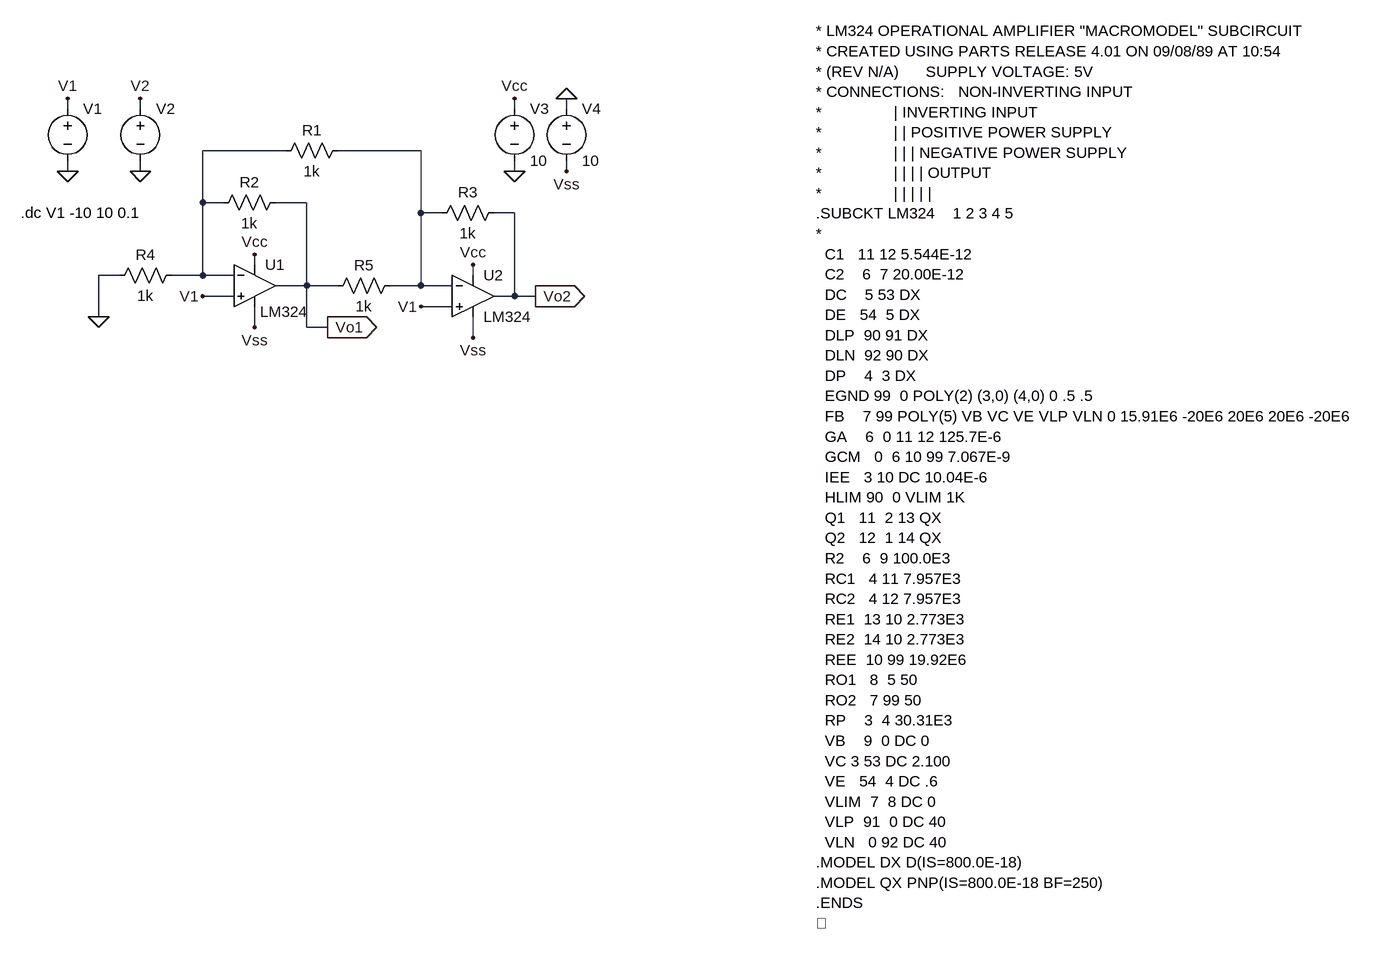
[diagram p0: schematic L1_C1.asc]
L1_C1.asc, the LTspice schematic file:
Version 4
SHEET 1 1776 1048
WIRE -144 -80 -144 -96
WIRE -32 -80 -32 -96
WIRE 544 -80 544 -96
WIRE 624 -80 624 -96
WIRE 192 -16 64 -16
WIRE 400 -16 272 -16
WIRE -144 16 -144 0
WIRE -32 16 -32 0
WIRE 544 16 544 0
WIRE 624 16 624 0
WIRE 64 64 64 -16
WIRE 96 64 64 64
WIRE 224 64 176 64
WIRE 400 80 400 -16
WIRE 432 80 400 80
WIRE 544 80 512 80
WIRE 144 160 144 144
WIRE -64 176 -96 176
WIRE 64 176 64 64
WIRE 64 176 16 176
WIRE 112 176 64 176
WIRE 480 176 480 160
WIRE 224 192 224 64
WIRE 224 192 176 192
WIRE 272 192 224 192
WIRE 400 192 400 80
WIRE 400 192 352 192
WIRE 448 192 400 192
WIRE 112 208 64 208
WIRE 544 208 544 80
WIRE 544 208 512 208
WIRE 576 208 544 208
WIRE 448 224 400 224
WIRE -96 240 -96 176
WIRE 144 256 144 224
WIRE 224 256 224 192
WIRE 256 256 224 256
WIRE 480 272 480 240
FLAG -144 16 0
FLAG -32 16 0
FLAG -96 240 0
FLAG 544 16 0
FLAG 64 208 V1
FLAG 400 224 V1
FLAG -144 -96 V1
FLAG -32 -96 V2
FLAG 624 -96 0
FLAG 544 -96 Vcc
FLAG 144 144 Vcc
FLAG 480 160 Vcc
FLAG 624 16 Vss
FLAG 480 272 Vss
FLAG 144 256 Vss
FLAG 576 208 Vo2
IOPIN 576 208 Out
FLAG 256 256 Vo1
IOPIN 256 256 Out
SYMBOL res 288 -32 R90
WINDOW 0 0 56 VBottom 2
WINDOW 3 32 56 VTop 2
SYMATTR InstName R1
SYMATTR Value 1k
SYMBOL res 192 48 R90
WINDOW 0 0 56 VBottom 2
WINDOW 3 32 56 VTop 2
SYMATTR InstName R2
SYMATTR Value 1k
SYMBOL res 528 64 R90
WINDOW 0 0 56 VBottom 2
WINDOW 3 32 56 VTop 2
SYMATTR InstName R3
SYMATTR Value 1k
SYMBOL res 32 160 R90
WINDOW 0 0 56 VBottom 2
WINDOW 3 32 56 VTop 2
SYMATTR InstName R4
SYMATTR Value 1k
SYMBOL voltage -144 -96 R0
WINDOW 123 0 0 Left 0
WINDOW 39 0 0 Left 0
WINDOW 3 -50 -37 VRight 2
SYMATTR Value ""
SYMATTR InstName V1
SYMBOL voltage -32 -96 R0
WINDOW 123 0 0 Left 0
WINDOW 39 0 0 Left 0
WINDOW 3 -49 -44 VRight 2
SYMATTR Value ""
SYMATTR InstName V2
SYMBOL voltage 544 -96 R0
WINDOW 123 0 0 Left 0
WINDOW 39 0 0 Left 0
SYMATTR InstName V3
SYMATTR Value 10
SYMBOL voltage 624 -96 R0
WINDOW 123 0 0 Left 0
WINDOW 39 0 0 Left 0
SYMATTR InstName V4
SYMATTR Value 10
SYMBOL res 368 176 R90
WINDOW 0 0 56 VBottom 2
WINDOW 3 32 56 VTop 2
SYMATTR InstName R5
SYMATTR Value 1k
SYMBOL OpAmps\\opamp2 144 128 R0
WINDOW 3 8 104 Left 2
SYMATTR Value LM324
SYMATTR InstName U1
SYMBOL OpAmps\\opamp2 480 144 R0
SYMATTR InstName U2
SYMATTR Value LM324
TEXT -216 80 Left 2 !.dc V1 -10 10 0.1
TEXT 1008 -200 Left 2 !* LM324 OPERATIONAL AMPLIFIER "MACROMODEL" SUBCIRCUIT\n* CREATED USING PARTS RELEASE 4.01 ON 09/08/89 AT 10:54\n* (REV N/A)      SUPPLY VOLTAGE: 5V\n* CONNECTIONS:   NON-INVERTING INPUT\n*                | INVERTING INPUT\n*                | | POSITIVE POWER SUPPLY\n*                | | | NEGATIVE POWER SUPPLY\n*                | | | | OUTPUT\n*                | | | | |\n.SUBCKT LM324    1 2 3 4 5\n*\n  C1   11 12 5.544E-12\n  C2    6  7 20.00E-12\n  DC    5 53 DX\n  DE   54  5 DX\n  DLP  90 91 DX\n  DLN  92 90 DX\n  DP    4  3 DX\n  EGND 99  0 POLY(2) (3,0) (4,0) 0 .5 .5\n  FB    7 99 POLY(5) VB VC VE VLP VLN 0 15.91E6 -20E6 20E6 20E6 -20E6\n  GA    6  0 11 12 125.7E-6\n  GCM   0  6 10 99 7.067E-9\n  IEE   3 10 DC 10.04E-6\n  HLIM 90  0 VLIM 1K\n  Q1   11  2 13 QX\n  Q2   12  1 14 QX\n  R2    6  9 100.0E3\n  RC1   4 11 7.957E3\n  RC2   4 12 7.957E3\n  RE1  13 10 2.773E3\n  RE2  14 10 2.773E3\n  REE  10 99 19.92E6\n  RO1   8  5 50\n  RO2   7 99 50\n  RP    3  4 30.31E3\n  VB    9  0 DC 0\n  VC 3 53 DC 2.100\n  VE   54  4 DC .6\n  VLIM  7  8 DC 0\n  VLP  91  0 DC 40\n  VLN   0 92 DC 40\n.MODEL DX D(IS=800.0E-18)\n.MODEL QX PNP(IS=800.0E-18 BF=250)\n.ENDS\n

The netlist it stands for:
* L1_C1.asc
R1 N002 N001 1k
R2 Vo1 N001 1k
R3 Vo2 N002 1k
R4 N001 0 1k
V1 V1 0
V2 V2 0
V3 Vcc 0 10
V4 0 Vss 10
R5 N002 Vo1 1k
XU1 V1 N001 Vcc Vss Vo1 LM324  ; pins In+ In- V+ V- OUT
XU2 V1 N002 Vcc Vss Vo2 LM324  ; pins In+ In- V+ V- OUT
.dc V1 -10 10 0.1
* LM324 OPERATIONAL AMPLIFIER "MACROMODEL" SUBCIRCUIT
* CREATED USING PARTS RELEASE 4.01 ON 09/08/89 AT 10:54
* (REV N/A)      SUPPLY VOLTAGE: 5V
* CONNECTIONS:   NON-INVERTING INPUT
*                | INVERTING INPUT
*                | | POSITIVE POWER SUPPLY
*                | | | NEGATIVE POWER SUPPLY
*                | | | | OUTPUT
*                | | | | |
.SUBCKT LM324    1 2 3 4 5
*
  C1   11 12 5.544E-12
  C2    6  7 20.00E-12
  DC    5 53 DX
  DE   54  5 DX
  DLP  90 91 DX
  DLN  92 90 DX
  DP    4  3 DX
  EGND 99  0 POLY(2) (3,0) (4,0) 0 .5 .5
  FB    7 99 POLY(5) VB VC VE VLP VLN 0 15.91E6 -20E6 20E6 20E6 -20E6
  GA    6  0 11 12 125.7E-6
  GCM   0  6 10 99 7.067E-9
  IEE   3 10 DC 10.04E-6
  HLIM 90  0 VLIM 1K
  Q1   11  2 13 QX
  Q2   12  1 14 QX
  R2    6  9 100.0E3
  RC1   4 11 7.957E3
  RC2   4 12 7.957E3
  RE1  13 10 2.773E3
  RE2  14 10 2.773E3
  REE  10 99 19.92E6
  RO1   8  5 50
  RO2   7 99 50
  RP    3  4 30.31E3
  VB    9  0 DC 0
  VC 3 53 DC 2.100
  VE   54  4 DC .6
  VLIM  7  8 DC 0
  VLP  91  0 DC 40
  VLN   0 92 DC 40
.MODEL DX D(IS=800.0E-18)
.MODEL QX PNP(IS=800.0E-18 BF=250)
.ENDS

.backanno
.end

* Results of the author's LTspice run, read from the files saved beside the schematic
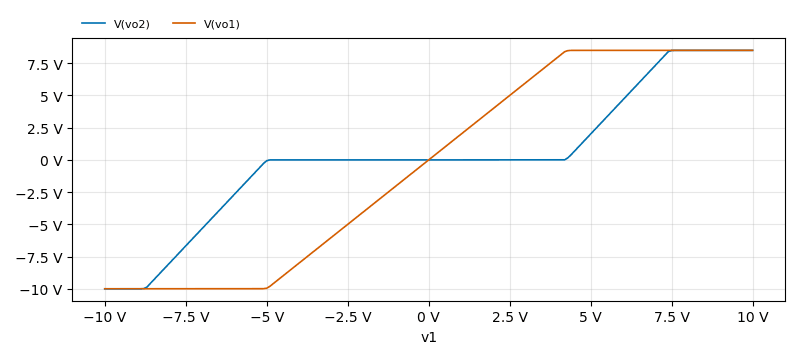
[diagram p1: DC transfer characteristic of L1_C1.asc, plotted from the saved traces]
* DC transfer characteristic, 1 run:
*   V(vo2): -9.996 V at v1=-10 V, 8.494 V at v1=10 V, min -9.996 V, max 8.494 V
*   V(vo1): -9.996 V at v1=-10 V, 8.495 V at v1=10 V, min -9.996 V, max 8.495 V